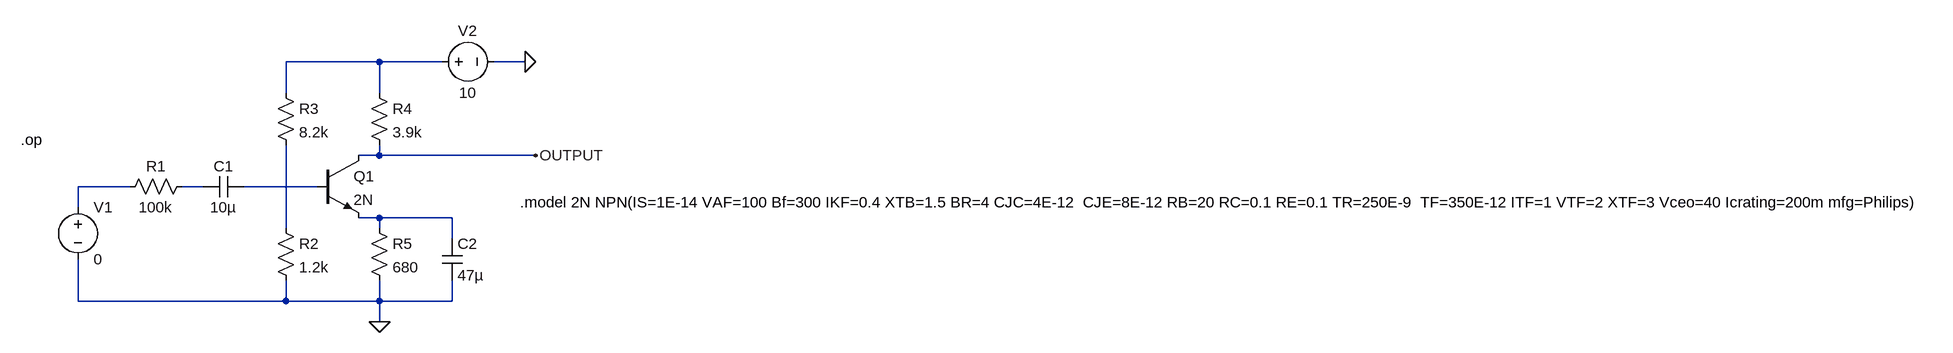
[diagram p0: schematic Lab5.asc]
Lab5.asc, the LTspice schematic file:
Version 4
SHEET 1 3084 680
WIRE 464 -128 320 -128
WIRE 560 -128 464 -128
WIRE 688 -128 640 -128
WIRE 320 -80 320 -128
WIRE 464 -80 464 -128
WIRE 464 16 464 0
WIRE 464 16 432 16
WIRE 704 16 464 16
WIRE 80 64 0 64
WIRE 192 64 160 64
WIRE 368 64 256 64
WIRE 0 96 0 64
WIRE 464 112 432 112
WIRE 576 112 464 112
WIRE 320 128 320 0
WIRE 464 128 464 112
WIRE 576 144 576 112
WIRE 0 240 0 176
WIRE 320 240 320 208
WIRE 320 240 0 240
WIRE 464 240 464 208
WIRE 464 240 320 240
WIRE 576 240 576 208
WIRE 576 240 464 240
WIRE 464 272 464 240
FLAG 464 272 0
FLAG 688 -128 0
FLAG 704 16 OUTPUT
SYMBOL res 176 48 R90
WINDOW 0 0 56 VBottom 2
WINDOW 3 32 56 VTop 2
SYMATTR InstName R1
SYMATTR Value 100k
SYMBOL cap 256 48 R90
WINDOW 0 0 32 VBottom 2
WINDOW 3 32 32 VTop 2
SYMATTR InstName C1
SYMATTR Value 10µ
SYMBOL voltage 0 80 R0
WINDOW 123 0 0 Left 0
WINDOW 39 0 0 Left 0
SYMATTR InstName V1
SYMATTR Value 0
SYMBOL res 304 112 R0
SYMATTR InstName R2
SYMATTR Value 1.2k
SYMBOL res 304 -96 R0
SYMATTR InstName R3
SYMATTR Value 8.2k
SYMBOL res 448 -96 R0
SYMATTR InstName R4
SYMATTR Value 3.9k
SYMBOL res 448 112 R0
SYMATTR InstName R5
SYMATTR Value 680
SYMBOL cap 560 144 R0
SYMATTR InstName C2
SYMATTR Value 47µ
SYMBOL npn 368 16 R0
SYMATTR InstName Q1
SYMATTR Value 2N
SYMBOL voltage 544 -128 R270
WINDOW 0 32 56 VTop 2
WINDOW 3 -32 56 VBottom 2
WINDOW 123 0 0 Left 0
WINDOW 39 0 0 Left 0
SYMATTR InstName V2
SYMATTR Value 10
TEXT -88 -8 Left 2 !.op
TEXT 680 88 Left 2 !.model 2N NPN(IS=1E-14 VAF=100 Bf=300 IKF=0.4 XTB=1.5 BR=4 CJC=4E-12  CJE=8E-12 RB=20 RC=0.1 RE=0.1 TR=250E-9  TF=350E-12 ITF=1 VTF=2 XTF=3 Vceo=40 Icrating=200m mfg=Philips)

The netlist it stands for:
* Lab5.asc
R1 N003 N002 100k
C1 N004 N003 10µ
V1 N002 0 0
R2 N006 0 1.2k
R3 N001 N006 8.2k
R4 N001 OUTPUT 3.9k
R5 N005 0 680
C2 N005 0 47µ
Q1 OUTPUT N004 N005 0 2N
V2 N001 0 10
.model NPN NPN
.model PNP PNP
.lib standard.bjt
.op
.model 2N NPN(IS=1E-14 VAF=100 Bf=300 IKF=0.4 XTB=1.5 BR=4 CJC=4E-12  CJE=8E-12 RB=20 RC=0.1 RE=0.1 TR=250E-9  TF=350E-12 ITF=1 VTF=2 XTF=3 Vceo=40 Icrating=200m mfg=Philips)
.backanno
.end